# EAGLE schematic PIC18F2550-USB-HID-LC-Meter (EAGLE 7.7.0)
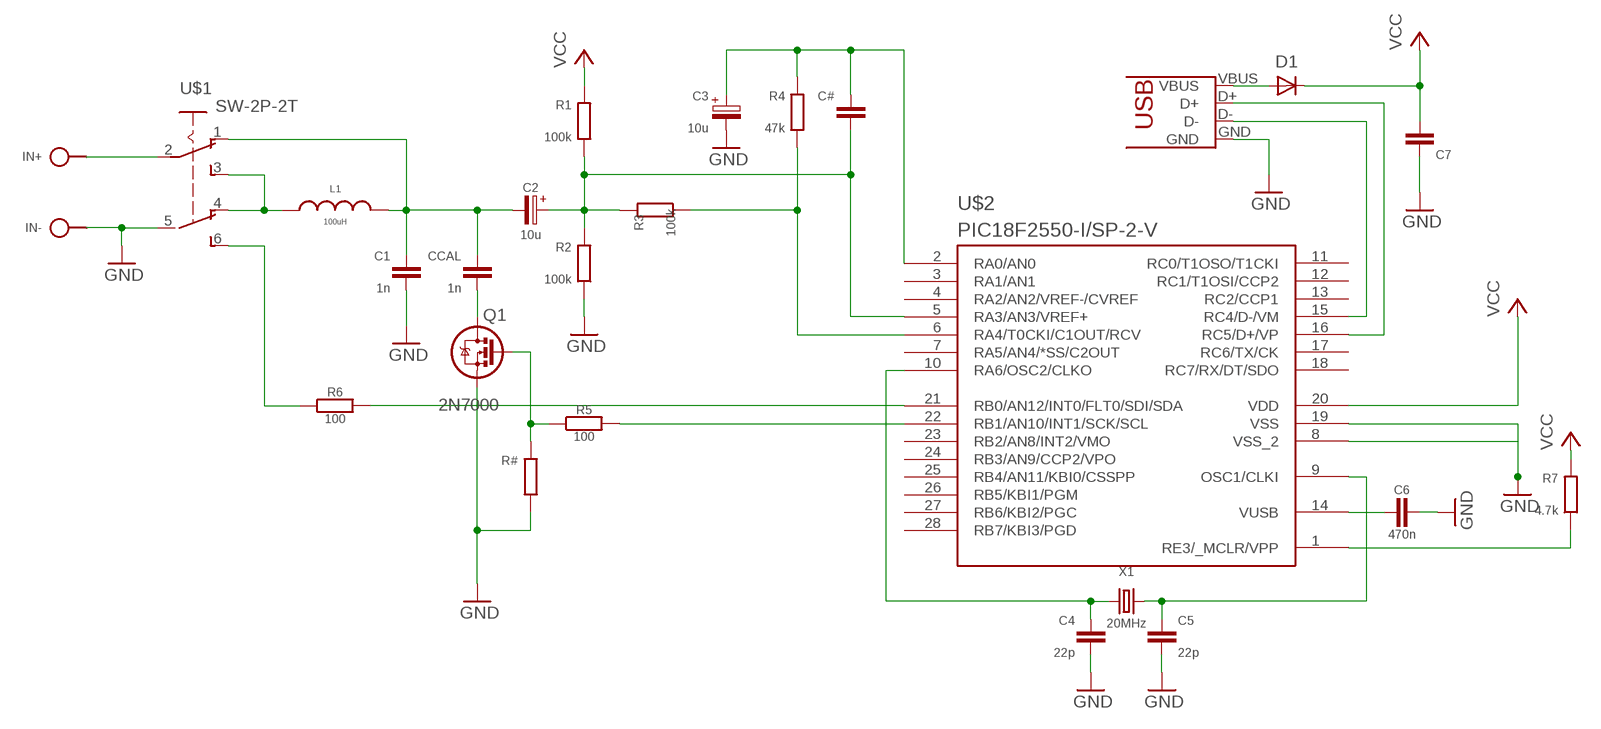
[diagram p0: schematic, sheet 1]

## Parts
C1  1n  C050-020X036  [C050-020X036]
C2  10u  CPOLE2,5-4/V  [E2.5-4/V]
C3  10u  CPOLE2,5-4  [E2,5-4]
C4  22p  C025-015X024  [C025-015X024/V]
C5  22p  C025-015X024  [C025-015X024/V]
C6  470n  C050-020X036  [C050-020X036]
C7  C050-020X036  [C050-020X036]
C#  C050-020X036  [C050-020X036]
CCAL  1n  C050-020X036  [C050-020X036]
D1  1N414834-5  [DO34-5]
IN+  SPAD  [SPAD]
IN-  SPAD  [SPAD]
J1  USB-PRINT  [USB-B-PRINT]
L1  100uH  L04/7-M  [L-04/10-M]
Q1  2N7000  [TO92]
R1  100k  R0202/7  [0202/7]
R2  100k  R0202/7  [0202/7]
R3  100k  R0202/7  [0202/7]
R4  47k  R0202/7  [0202/7]
R5  100  R0202/7  [0202/7]
R6  100  R0202/7  [0202/7]
R7  4.7k  R0202/7  [0202/7]
R#  R0202/7  [0202/7]
U$1  SW-2P-2T  [SLSW-2P2T]
U$2  PIC18F2550-I/SP-2-V  [DIL28-3/V]
X1  20MHz  CRYSTALHC49  [HC49]

## Nets
GND: C1.2 C3.- C4.2 C5.2 C6.2 C7.1 IN-.1 J1.GND Q1.1(S) R2.1 R#.1 U$1.5(P1) U$2.8(VSS_2) U$2.19(VSS)
N$1: Q1.2(G) R5.1 R#.2
N$2: R7.1 U$2.1(RE3/_MCLR/VPP)
N$3: J1.D- U$2.15(RC4/D-/VM)
N$4: J1.D+ U$2.16(RC5/D+/VP)
N$6: C2.+ C#.2 R1.1 R2.2 R3.2 U$2.5(RA3/AN3/VREF+)
N$7: C3.+ C#.1 R4.2 U$2.2(RA0/AN0)
N$8: R3.1 R4.1 U$2.6(RA4/T0CKI/C1OUT/RCV)
N$9: C1.1 C2.- CCAL.1 L1.2 U$1.1(O)
N$10: R5.2 U$2.22(RB1/AN10/INT1/SCK/SCL)
N$11: CCAL.2 Q1.3(D)
N$12: C4.1 U$2.10(RA6/OSC2/CLKO) X1.1
N$13: C5.1 U$2.9(OSC1/CLKI) X1.2
N$14: C6.1 U$2.14(VUSB)
N$15: L1.1 U$1.3(S) U$1.4(O1)
N$16: IN+.1 U$1.2(P)
N$17: R6.1 U$1.6(S1)
N$18: R6.2 U$2.21(RB0/AN12/INT0/FLT0/SDI/SDA)
VCC: C7.2 D1.C R1.2 R7.2 U$2.20(VDD)
VDD: D1.A J1.VBUS
Unconnected: U$2.3(RA1/AN1) U$2.4(RA2/AN2/VREF-/CVREF) U$2.7(RA5/AN4/*SS/C2OUT) U$2.11(RC0/T1OSO/T1CKI) U$2.12(RC1/T1OSI/CCP2) U$2.13(RC2/CCP1) U$2.17(RC6/TX/CK) U$2.18(RC7/RX/DT/SDO) U$2.23(RB2/AN8/INT2/VMO) U$2.24(RB3/AN9/CCP2/VPO) U$2.25(RB4/AN11/KBI0/CSSPP) U$2.26(RB5/KBI1/PGM) U$2.27(RB6/KBI2/PGC) U$2.28(RB7/KBI3/PGD)

## Library data of the parts
C1 C4-C7 C# CCAL = c:C: CAPACITOR, European symbol
C2 C3 = c:CPOL: POLARIZED CAPACITOR, European symbol
D1 = d:1N4148
IN+ IN- = pad:SPAD
J1 = usb:USB: USB Connectors USB-B-PTH is fully proven SKU : PRT-00139 USB-miniB is fully proven SKU : PRT-00587 USB-A-PCB is untested. USB-A-H is throughly reviewed, but untested. Spark Fun Electronics SKU : PRT-00437 USB-B-SMT is throughly reviewed, but untested. Needs silkscreen touching up. USB-A-S has not been used/tested USB-MB-H has not been used/tested
L1 = r:L
Q1 = t:2N7000
R1-R7 R# = r:R: RESISTOR, European symbol
U$1 = sw:SW-2P-2T
U$2 = mcu:PIC18F2550-I/SP-2
X1 = q:CRYSTAL